# EAGLE design esquema TTH v03 filled (EAGLE 6.5.0)
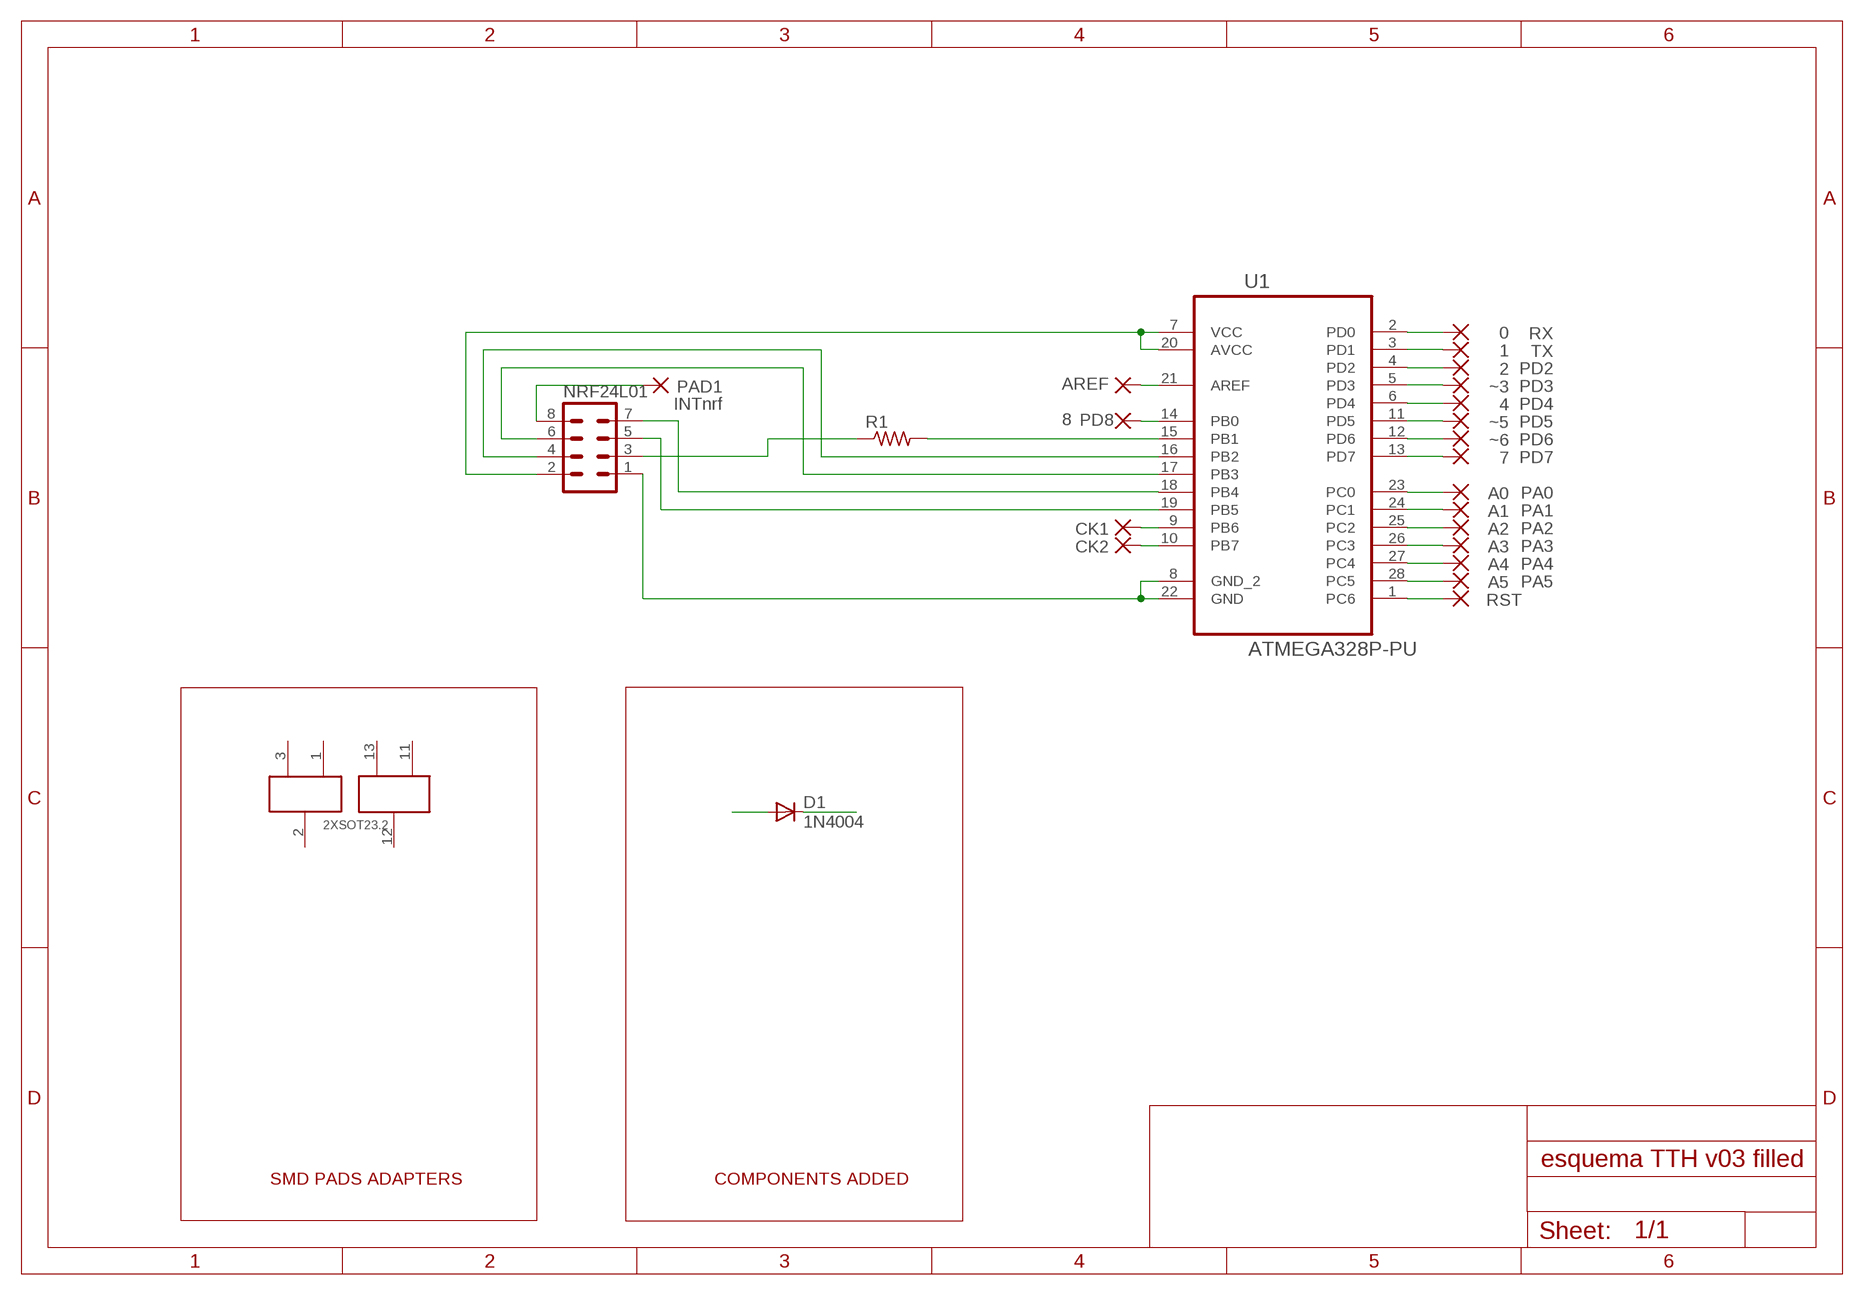
[diagram p0: schematic, sheet 1]

## Parts
2  PD2  2,15/1,0  [2,15/1,0]
4  PD4  2,15/1,0  [2,15/1,0]
7  PD7  2,15/1,0  [2,15/1,0]
8  PD8  2,15/1,0  [2,15/1,0]
A0  PA0  2,15/1,0  [2,15/1,0]
A1  PA1  2,15/1,0  [2,15/1,0]
A2  PA2  2,15/1,0  [2,15/1,0]
A3  PA3  2,15/1,0  [2,15/1,0]
A4  PA4  2,15/1,0  [2,15/1,0]
A5  PA5  2,15/1,0  [2,15/1,0]
AREF  2,15/1,0  [2,15/1,0]
CK1  2,15/1,0  [2,15/1,0]
CK2  2,15/1,0  [2,15/1,0]
D1  1N4004  [DO41-10]
NRF24L01  MA04-2  [MA04-2]
PAD1  INTnrf  2,15/1,0  [2,15/1,0]
R1  R-US_0207/10  [0207/10]
RST  2,15/1,0  [2,15/1,0]
RX  0  2,15/1,0  [2,15/1,0]
TX  1  2,15/1,0  [2,15/1,0]
U1  ATMEGA328P-PU  [DIP254P762X457-28]
U$2  2XSOT23.2  [SOT23.5]
~3  PD3  2,15/1,0  [2,15/1,0]
~5  PD5  2,15/1,0  [2,15/1,0]
~6  PD6  2,15/1,0  [2,15/1,0]

## Nets
N$2: NRF24L01.4 U1.16(PB2)
N$3: NRF24L01.8 PAD1.1(P)
N$4: NRF24L01.6 U1.17(PB3)
N$5: NRF24L01.3 R1.1
N$6: NRF24L01.5 U1.19(PB5)
N$8: R1.2 U1.15(PB1)
N$10: CK2.1(P) U1.10(PB7)
N$11: CK1.1(P) U1.9(PB6)
N$12: AREF.1(P) U1.21(AREF)
N$13: 8.1(P) U1.14(PB0)
N$14: RX.1(P) U1.2(PD0)
N$15: TX.1(P) U1.3(PD1)
N$16: 2.1(P) U1.4(PD2)
N$17: U1.5(PD3) ~3.1(P)
N$18: 4.1(P) U1.6(PD4)
N$19: U1.11(PD5) ~5.1(P)
N$20: U1.12(PD6) ~6.1(P)
N$21: 7.1(P) U1.13(PD7)
N$22: A0.1(P) U1.23(PC0)
N$23: A1.1(P) U1.24(PC1)
N$24: A2.1(P) U1.25(PC2)
N$25: A3.1(P) U1.26(PC3)
N$26: A4.1(P) U1.27(PC4)
N$27: A5.1(P) U1.28(PC5)
N$28: RST.1(P) U1.1(PC6)
N$29: NRF24L01.7 U1.18(PB4)
N$164: NRF24L01.2 U1.7(VCC) U1.20(AVCC)
N$178: D1.A
N$179: D1.C
N$191: NRF24L01.1 U1.8(GND_2) U1.22(GND)
Unconnected: U$2.1 U$2.2 U$2.3 U$2.11 U$2.12 U$2.13

## Notes on the sheet
- SMD PADS ADAPTERS | COMPONENTS ADDED

## Library data of the parts
2 4 7 8 A0 A1-A5 AREF CK1 CK2 PAD1 RST RX TX ~3 ~5 ~6 = wirepad:2,15/1,0: THROUGH-HOLE PAD
D1 = diode:1N4004: DIODE general purpose rectifier, 1 A
NRF24L01 = con-lstb:MA04-2: PIN HEADER; OC_FARNELL: unknown; OC_NEWARK: unknown
R1 = rcl:R-US_: RESISTOR, American symbol
U1 = Atmel_By_element14_Batch_1-00:ATMEGA328P-PU: 8-bit Microcontroller with In-System Programmable Flash; MPN: ATMEGA328P-PU; OC_FARNELL: 1715487; OC_NEWARK: 15R0268; PACKAGE: PDIP-28; SUPPLIER: Atmel
U$2 = smd-adapter:2XSOT23.2

## Board
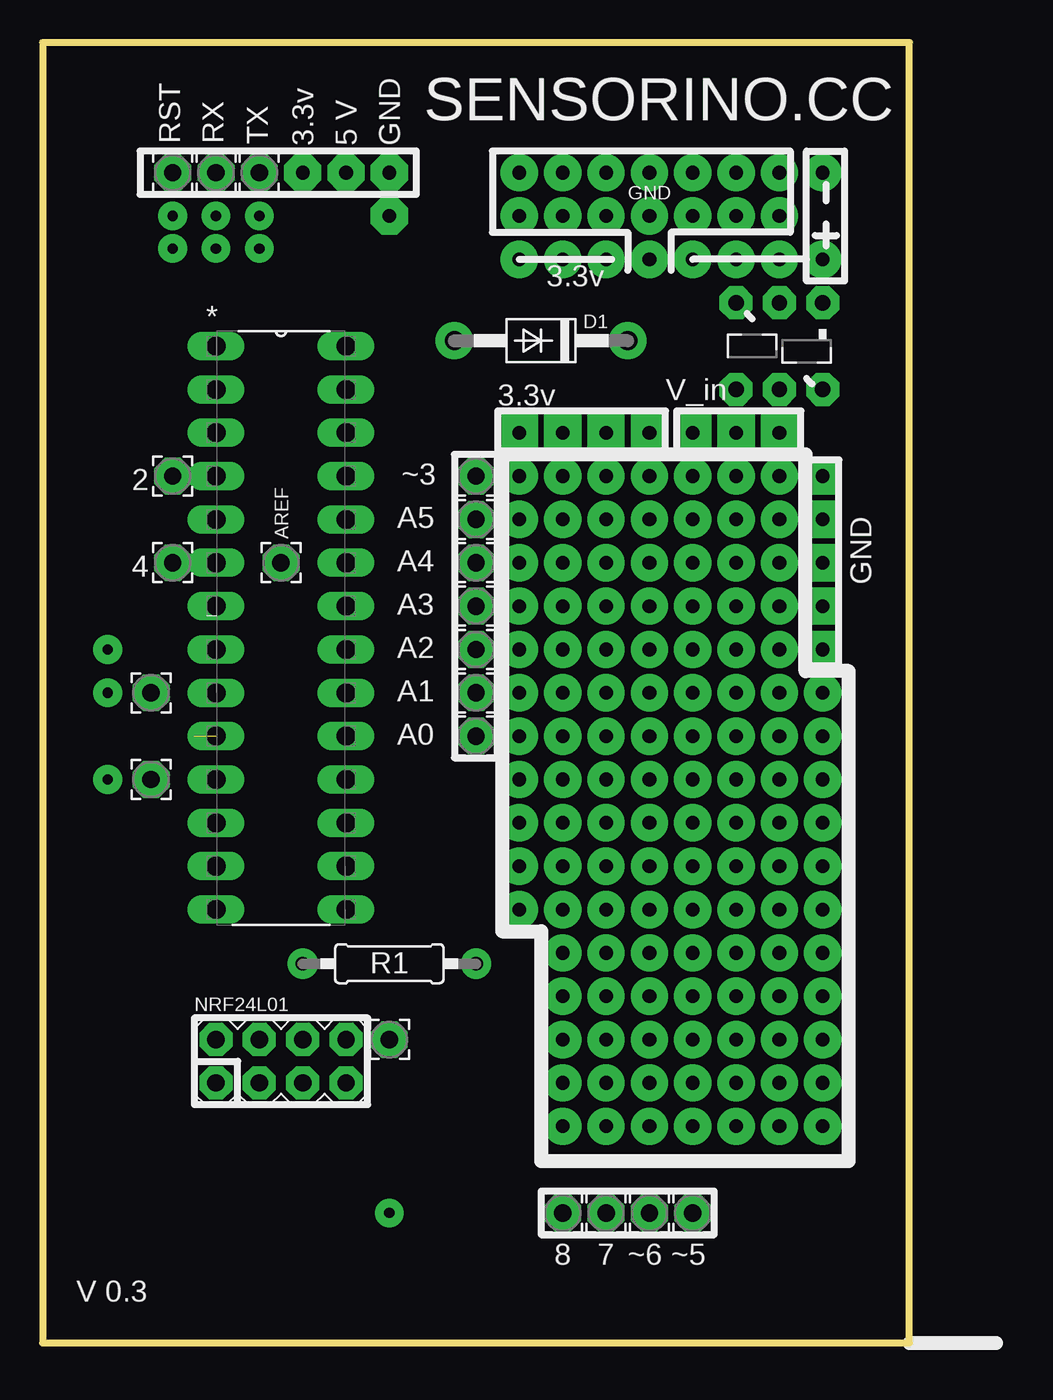
[diagram p1: board, top side]
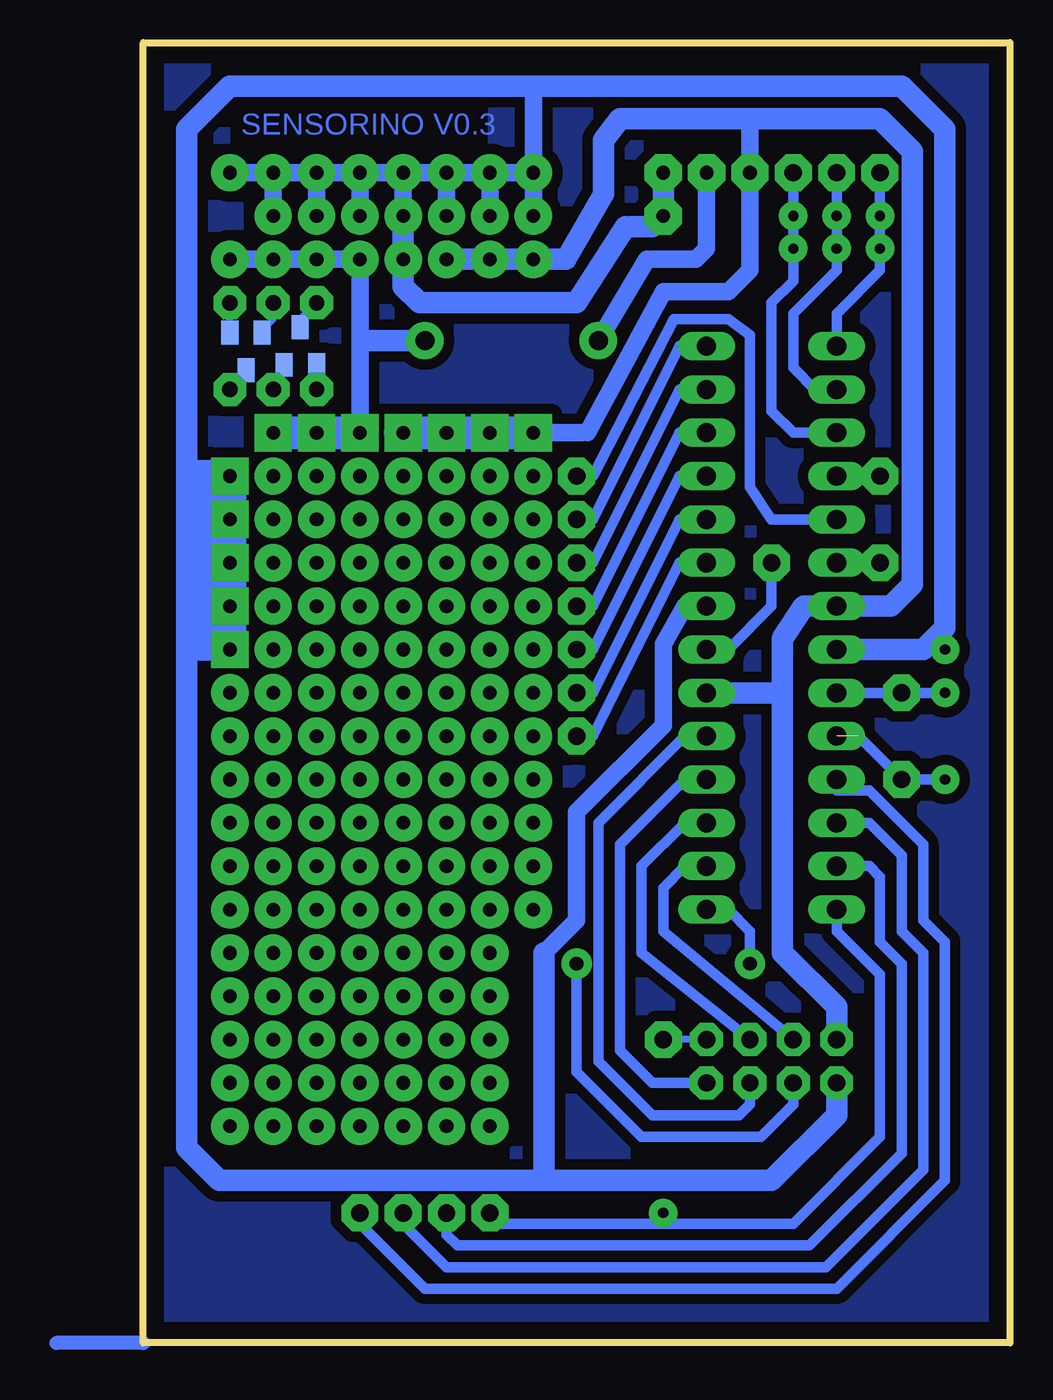
[diagram p2: board, bottom side, seen from below]

Size 50.8 x 76.2 mm. Coordinates in mm from the lower left corner, seen from the top.
Outline: 0,76.2 0,0 50.8,0 50.8,76.2 0,76.2
Copper layers (1*16): Top 0.035mm / dielectric 1.5mm / Bottom 0.035mm
Design rules "default": minimum track width 10mil, minimum drill 24mil, track to track 8mil, track to pad 8mil, pad to pad 8mil, via to via 8mil, smd to smd 8mil, copper to edge 40mil, drill to drill 8mil, minimum pad ring 10mil, minimum via ring 8mil, stop-mask expansion 4mil, vias tented up to drill 0mil, thermal gap 10mil

### Footprints (pad centres in the part's own frame; a part is rotated, then mirrored left to right if it is on the bottom)
2,15/1,0 = drill 1.016 pad 2.159 octagon: 1 0,0
DO41-10 = drill 1.118: A 5.08,0; C -5.08,0
MA04-2 = drill 1.016 pad 1.93 octagon: 1 -3.81,-1.27; 2 -3.81,1.27; 3 -1.27,-1.27; 4 -1.27,1.27; 5 1.27,-1.27; 6 1.27,1.27; 7 3.81,-1.27; 8 3.81,1.27
0207/10 = drill 0.813 octagon: 1 -5.08,0; 2 5.08,0
DIP254P762X457-28 = drill 1.118 long: 1 -7.62,33.02; 2 -7.62,30.48; 3 -7.62,27.94; 4 -7.62,25.4; 5 -7.62,22.86; 6 -7.62,20.32; 7 -7.62,17.78; 8 -7.62,15.24; 9 -7.62,12.7; 10 -7.62,10.16; 11 -7.62,7.62; 12 -7.62,5.08; 13 -7.62,2.54; 14 -7.62,0; 15 0,0; 16 0,2.54; 17 0,5.08; 18 0,7.62; 19 0,10.16; 20 0,12.7; 21 0,15.24; 22 0,17.78; 23 0,20.32; 24 0,22.86; 25 0,25.4; 26 0,27.94; 27 0,30.48; 28 0,33.02
SOT23.5 = drill 0.9 pad 1.93 octagon: 1 -2.54,-2.54; 2 -2.54,2.54; 3 0,-2.54; 11 2.54,2.54; 12 2.54,-2.54; 13 0,2.54 | smd 1 x 1.4 bottom: NC6 -1.587,1.417; NC7 -0.637,-0.782; NC8 -2.538,-0.782; NC9 1.587,-1.1; NC10 0.637,1.1; NC11 2.538,1.1

### Placement (x,y rotation side)
2  7.62,50.8 0 top
4  7.62,45.72 0 top
7  33.02,7.62 0 top
8  30.48,7.62 0 top
A0  25.4,35.56 0 top
A1  25.4,38.1 0 top
A2  25.4,40.64 0 top
A3  25.4,43.18 0 top
A4  25.4,45.72 0 top
A5  25.4,48.26 0 top
AREF  13.97,45.72 0 top
CK1  6.35,38.1 0 top
CK2  6.35,33.02 0 top
D1  29.21,58.74 180 top
NRF24L01  13.97,16.51 0 top
PAD1  20.32,17.78 90 top
R1  20.32,22.23 180 top
RST  7.62,68.58 0 top
RX  10.16,68.58 0 top
TX  12.7,68.58 0 top
U1  17.78,25.4 0 top
U$2  43.18,58.42 180 top
~3  25.4,50.8 0 top
~5  38.1,7.62 0 top
~6  35.56,7.62 0 top

### Tracks (layer width: path | path; a pad name or v marks a point on that pad's centre or on a via)
N$1
  Bottom 1.016: 38.1,63.18 38.1,53.66
N$2
  Bottom 0.61: U1.16 19.05,27.94 20.32,26.67 20.32,24.13 NRF24L01.4
N$3
  Bottom 0.406: NRF24L01.8 PAD1.1
N$4
  Bottom 0.61: U1.17 19.05,30.48 21.59,27.94 21.59,22.86 NRF24L01.6
N$5
  Bottom 0.61: NRF24L01.3 12.7,13.97 14.61,12.06 21.59,12.06 25.4,15.88 R1.1
N$6
  Bottom 0.61: U1.19 19.05,35.56 24.13,30.48 24.13,16.51 20.95,13.34 15.88,13.34 15.24,13.97 NRF24L01.5
N$7  (via drill 0.6 pad 1.68)
  other vias: 3.81,33.02
N$8
  Bottom 0.61: U1.15 16.51,25.4 15.24,24.13 R1.2
N$9  (via drill 0.6 pad 1.68)
  other vias: 3.81,38.1
N$10  (1 unrouted)
  Bottom 0.61: CK2.1 8.89,35.56
N$11
  Bottom 0.61: U1.9 CK1.1
N$12
  Bottom 0.61: AREF.1 13.97,43.18 16.51,40.64 U1.21
N$13
  Bottom 0.61: U1.14 10.16,24.13 7.62,21.59 7.62,12.06 12.7,6.99 29.84,6.99 8.1
N$14
  Bottom 0.61: U1.2 11.43,55.88 12.7,57.15 12.7,60.33 10.16,62.87 RX.1
N$15
  Bottom 0.61: U1.3 12.7,53.34 13.97,54.61 13.97,60.96 12.7,62.23 TX.1
N$16
  Bottom 0.61: 2.1 U1.4
N$17
  Bottom 0.61: U1.5 13.97,48.26 15.24,50.16 15.24,59.05 16.51,60.01 19.68,60.01 24.45,50.8 ~3.1
N$18
  Bottom 0.61: 4.1 U1.6
N$19
  Bottom 0.61: U1.11 10.16,32.38 8.26,32.38 5.08,29.21 5.08,24.77 3.81,23.5 3.81,9.53 10.16,3.17 34.29,3.17 38.1,6.99 ~5.1
N$20
  Bottom 0.61: U1.12 8.26,30.48 6.35,28.57 6.35,24.13 5.08,22.86 5.08,10.16 10.79,4.45 33.02,4.45 35.56,6.99 ~6.1
N$21
  Bottom 0.61: U1.13 8.26,27.94 7.62,27.3 7.62,23.5 6.35,22.23 6.35,11.11 11.75,5.71 32.38,5.71 33.02,6.35 7.1
N$22
  Bottom 0.61: U1.23 19.37,45.72 24.45,35.56 A0.1
N$23
  Bottom 0.61: U1.24 19.37,48.26 24.45,38.1 A1.1
N$24
  Bottom 0.61: U1.25 19.37,50.8 24.45,40.64 A2.1
N$25
  Bottom 0.61: U1.26 19.37,53.34 24.45,43.18 A3.1
N$26
  Bottom 0.61: U1.27 19.37,55.88 24.45,45.72 A4.1
N$27
  Bottom 0.61: U1.28 19.37,58.42 24.45,48.26 A5.1
N$28
  Bottom 0.61: U1.1 10.16,60.33 7.62,62.87 RST.1
N$29
  Bottom 0.61: 19.05,15.24 NRF24L01.7 20.95,15.24 22.86,17.14 22.86,29.21 19.05,33.02 U1.18
N$30  (via drill 0.8 pad 2.18)
  Bottom 1.016: v45.72,63.5 v38.1,63.5
N$31  (via drill 0.6 pad 1.68)
  other vias: 20.32,7.62
N$32
  Bottom 1.016: 24.13,58.74 21.27,63.5
N$33
  Bottom 0.61: 3.49,33.02 6.35,33.02
N$34
  Bottom 0.61: 6.35,38.1 3.49,38.1
N$35  (via drill 0.6 pad 1.68)
  other vias: 3.81,40.64
N$36  (via drill 0.6 pad 1.68)
  other vias: 12.7,66.04
N$37  (via drill 0.8 pad 2.18)
  other vias: 38.1,12.7
N$38  (via drill 0.8 pad 2.18)
  other vias: 40.64,12.7
N$39  (via drill 0.8 pad 2.18)
  other vias: 43.18,12.7
N$40  (via drill 0.8 pad 2.18)
  other vias: 35.56,12.7
N$41  (via drill 0.8 pad 2.18)
  other vias: 33.02,12.7
N$42  (via drill 0.8 pad 2.18)
  other vias: 30.48,12.7
N$43  (via drill 0.8 pad 2.18)
  other vias: 30.48,15.24
N$44  (via drill 0.8 pad 2.18)
  other vias: 33.02,15.24
N$45  (via drill 0.8 pad 2.18)
  other vias: 35.56,15.24
N$46  (via drill 0.8 pad 2.18)
  other vias: 38.1,15.24
N$47  (via drill 0.8 pad 2.18)
  other vias: 40.64,15.24
N$48  (via drill 0.8 pad 2.18)
  other vias: 43.18,15.24
N$49  (via drill 0.8 pad 2.18)
  other vias: 45.72,15.24
N$50  (via drill 0.8 pad 2.18)
  other vias: 45.72,17.78
N$51  (via drill 0.8 pad 2.18)
  other vias: 43.18,17.78
N$52  (via drill 0.8 pad 2.18)
  other vias: 40.64,17.78
N$53  (via drill 0.8 pad 2.18)
  other vias: 38.1,17.78
N$54  (via drill 0.8 pad 2.18)
  other vias: 35.56,17.78
N$55  (via drill 0.8 pad 2.18)
  other vias: 33.02,17.78
N$56  (via drill 0.8 pad 2.18)
  other vias: 30.48,17.78
N$57  (via drill 0.8 pad 2.18)
  other vias: 30.48,20.32
N$58  (via drill 0.8 pad 2.18)
  other vias: 33.02,20.32
N$59  (via drill 0.8 pad 2.18)
  other vias: 35.56,20.32
N$60  (via drill 0.8 pad 2.18)
  other vias: 38.1,20.32
N$61  (via drill 0.8 pad 2.18)
  other vias: 40.64,20.32
N$62  (via drill 0.8 pad 2.18)
  other vias: 43.18,20.32
N$63  (via drill 0.8 pad 2.18)
  other vias: 45.72,20.32
N$64  (via drill 0.8 pad 2.18)
  other vias: 45.72,22.86
N$65  (via drill 0.8 pad 2.18)
  other vias: 43.18,22.86
N$66  (via drill 0.8 pad 2.18)
  other vias: 40.64,22.86
N$67  (via drill 0.8 pad 2.18)
  other vias: 38.1,22.86
N$68  (via drill 0.8 pad 2.18)
  other vias: 35.56,22.86
N$69  (via drill 0.8 pad 2.18)
  other vias: 33.02,22.86
N$70  (via drill 0.8 pad 2.18)
  other vias: 30.48,22.86
N$71  (via drill 0.8 pad 2.18)
  other vias: 30.48,25.4
N$72  (via drill 0.8 pad 2.18)
  other vias: 33.02,25.4
N$73  (via drill 0.8 pad 2.18)
  other vias: 35.56,25.4
N$74  (via drill 0.8 pad 2.18)
  other vias: 38.1,25.4
N$75  (via drill 0.8 pad 2.18)
  other vias: 40.64,25.4
N$76  (via drill 0.8 pad 2.18)
  other vias: 43.18,25.4
N$77  (via drill 0.8 pad 2.18)
  other vias: 45.72,25.4
N$78  (via drill 0.8 pad 2.18)
  other vias: 45.72,27.94
N$79  (via drill 0.8 pad 2.18)
  other vias: 43.18,27.94
N$80  (via drill 0.8 pad 2.18)
  other vias: 40.64,27.94
N$81  (via drill 0.8 pad 2.18)
  other vias: 38.1,27.94
N$82  (via drill 0.8 pad 2.18)
  other vias: 35.56,27.94
N$83  (via drill 0.8 pad 2.18)
  other vias: 33.02,27.94
N$84  (via drill 0.8 pad 2.18)
  other vias: 30.48,27.94
N$85  (via drill 0.8 pad 2.18)
  other vias: 30.48,30.48
N$86  (via drill 0.8 pad 2.18)
  other vias: 33.02,30.48
N$87  (via drill 0.8 pad 2.18)
  other vias: 35.56,30.48
N$88  (via drill 0.8 pad 2.18)
  other vias: 38.1,30.48
N$89  (via drill 0.8 pad 2.18)
  other vias: 40.64,30.48
N$90  (via drill 0.8 pad 2.18)
  other vias: 43.18,30.48
N$91  (via drill 0.8 pad 2.18)
  other vias: 45.72,30.48
N$92  (via drill 0.8 pad 2.18)
  other vias: 45.72,33.02
N$93  (via drill 0.8 pad 2.18)
  other vias: 43.18,33.02
N$94  (via drill 0.8 pad 2.18)
  other vias: 40.64,33.02
N$95  (via drill 0.8 pad 2.18)
  other vias: 38.1,33.02
N$96  (via drill 0.8 pad 2.18)
  other vias: 35.56,33.02
N$97  (via drill 0.8 pad 2.18)
  other vias: 33.02,33.02
N$98  (via drill 0.8 pad 2.18)
  other vias: 30.48,33.02
N$99  (via drill 0.8 pad 2.18)
  other vias: 30.48,35.56
N$100  (via drill 0.8 pad 2.18)
  other vias: 33.02,35.56
N$101  (via drill 0.8 pad 2.18)
  other vias: 35.56,35.56
N$102  (via drill 0.8 pad 2.18)
  other vias: 38.1,35.56
N$103  (via drill 0.8 pad 2.18)
  other vias: 40.64,35.56
N$104  (via drill 0.8 pad 2.18)
  other vias: 43.18,35.56
N$105  (via drill 0.8 pad 2.18)
  other vias: 45.72,35.56
N$106  (via drill 0.8 pad 2.18)
  other vias: 45.72,12.7
N$107  (via drill 0.8 pad 2.18)
  other vias: 45.72,38.1
N$108  (via drill 0.8 pad 2.18)
  other vias: 43.18,38.1
N$109  (via drill 0.8 pad 2.18)
  other vias: 40.64,38.1
N$110  (via drill 0.8 pad 2.18)
  other vias: 38.1,38.1
N$111  (via drill 0.8 pad 2.18)
  other vias: 35.56,38.1
N$112  (via drill 0.8 pad 2.18)
  other vias: 33.02,38.1
N$113  (via drill 0.8 pad 2.18)
  other vias: 30.48,38.1
N$114  (via drill 0.8 pad 2.18)
  other vias: 30.48,40.64
N$115  (via drill 0.8 pad 2.18)
  other vias: 33.02,40.64
N$116  (via drill 0.8 pad 2.18)
  other vias: 35.56,40.64
N$117  (via drill 0.8 pad 2.18)
  Bottom 1.27: 22.23,65.41 20.95,65.41 v20.32,66.04 20.32,67.94
N$118  (via drill 0.8 pad 2.18)
  other vias: 20.32,68.58
N$119  (via drill 0.8 pad 2.18)
  other vias: 35.56,63.5
N$120  (via drill 0.8 pad 2.18)
  other vias: 27.94,30.48
N$121  (via drill 0.8 pad 2.18)
  other vias: 27.94,27.94
N$122  (via drill 0.8 pad 2.18)
  other vias: 27.94,25.4
N$123  (via drill 0.8 pad 2.18)
  Bottom 1.016: 20.95,63.5 18.41,63.5 17.78,64.14 v17.78,68.58
N$124  (via drill 0.8 pad 2.18)
  other vias: 38.1,50.8
N$125  (via drill 0.8 pad 2.18)
  other vias: 35.56,43.18
N$126  (via drill 0.8 pad 2.18)
  other vias: 33.02,43.18
N$127  (via drill 0.8 pad 2.18)
  other vias: 30.48,43.18
N$128  (via drill 0.8 pad 2.18)
  other vias: 30.48,45.72
N$129  (via drill 0.8 pad 2.18)
  other vias: 33.02,45.72
N$130  (via drill 0.8 pad 2.18)
  other vias: 35.56,45.72
N$131  (via drill 0.8 pad 2.18)
  other vias: 40.64,50.8
N$132  (via drill 0.8 pad 2.18)
  other vias: 43.18,50.8
N$133
  Bottom 1.016: 25.08,53.34 35.24,53.34 36.2,53.34
N$134  (via drill 0.8 pad 2.18)
  other vias: 43.18,48.26
N$135  (via drill 0.8 pad 2.18)
  other vias: 45.72,48.26
N$136  (via drill 0.8 pad 2.18)
  other vias: 45.72,45.72
N$137  (via drill 0.8 pad 2.18)
  other vias: 45.72,43.18
N$138  (via drill 0.8 pad 2.18)
  other vias: 40.64,48.26
N$139  (via drill 0.8 pad 2.18)
  other vias: 35.56,48.26
N$140  (via drill 0.8 pad 2.18)
  other vias: 33.02,48.26
N$141  (via drill 0.8 pad 2.18)
  other vias: 30.48,48.26
N$142  (via drill 0.8 pad 2.18)
  other vias: 30.48,50.8
N$143  (via drill 0.8 pad 2.18)
  other vias: 33.02,50.8
N$144  (via drill 0.8 pad 2.18)
  other vias: 35.56,50.8
N$145  (via drill 0.8 pad 2.18)
  other vias: 38.1,48.26
N$146  (via drill 0.8 pad 2.18)
  other vias: 38.1,45.72
N$147  (via drill 0.8 pad 2.18)
  other vias: 40.64,45.72
N$148  (via drill 0.8 pad 2.18)
  other vias: 43.18,45.72
N$149  (via drill 0.8 pad 2.18)
  other vias: 43.18,43.18
N$150  (via drill 0.8 pad 2.18)
  other vias: 40.64,43.18
N$151  (via drill 0.8 pad 2.18)
  other vias: 38.1,43.18
N$152  (via drill 0.8 pad 2.18)
  other vias: 38.1,40.64
N$153  (via drill 0.8 pad 2.18)
  other vias: 35.56,53.34
N$154  (via drill 0.8 pad 2.18)
  other vias: 33.02,53.34
N$155  (via drill 0.8 pad 2.18)
  other vias: 30.48,53.34
N$156  (via drill 0.8 pad 2.18)
  other vias: 40.64,40.64
N$157  (via drill 0.8 pad 2.18)
  other vias: 27.94,40.64
N$158  (via drill 0.8 pad 2.18)
  other vias: 27.94,63.5
N$159  (via drill 0.8 pad 2.18)
  other vias: 30.48,68.58
N$160  (via drill 0.8 pad 2.18)
  Bottom 1.016: 30.48,67.94 v30.48,66.04
N$161  (via drill 0.8 pad 2.18)
  other vias: 30.48,63.5
N$162  (via drill 0.8 pad 2.18)
  Bottom 1.016: v33.02,68.58 v33.02,66.04
N$163  (via drill 0.8 pad 2.18)
  Bottom 1.016: v43.18,53.34 v40.64,53.34 v38.1,53.34
N$164  (via drill 0.8 pad 2.18)
  Bottom 1.016: 15.24,71.75 v15.24,68.58 15.24,62.87 16.51,61.59 20.32,61.59 24.77,53.34
  Bottom 1.27: v33.02,63.5 26.04,63.5 23.81,67.31 23.81,70.48 22.86,71.75 15.24,71.75 7.62,71.75 5.71,69.85 5.71,44.45 6.99,43.18 U1.7 12.06,43.18 13.34,41.27 13.34,38.1 | NRF24L01.2 10.16,19.68 13.34,22.86 13.34,38.1 | 13.34,38.1 U1.20
N$165  (via drill 0.8 pad 2.18)
  other vias: 35.56,68.58
N$166  (via drill 0.8 pad 2.18)
  other vias: 27.94,43.18
N$167  (via drill 0.8 pad 2.18)
  other vias: 43.18,40.64
N$168  (via drill 0.8 pad 2.18)
  other vias: 38.1,68.58
N$169  (via drill 0.8 pad 2.18)
  other vias: 27.94,45.72
N$170
  Bottom 1.27: 37.78,58.74 33.97,58.74
N$171  (via drill 0.6 pad 1.68)
  other vias: 7.62,66.04
N$172  (via drill 0.6 pad 1.68)
  other vias: 7.62,64.14
N$173  (via drill 0.6 pad 1.68)
  other vias: 10.16,64.14
N$174  (via drill 0.6 pad 1.68)
  other vias: 12.7,64.14
N$175  (via drill 0.6 pad 1.68)
  other vias: 10.16,66.04
N$176  (via drill 0.6 pad 1.78)
  other vias: 25.4,22.23
N$177  (via drill 0.6 pad 1.78)
  other vias: 15.24,22.23
N$180
  pour Bottom (isolate 0.61): 50.8,0 0,0 0,76.2 50.8,76.2
N$181  (via drill 0.8 pad 2.18)
  other vias: 27.94,33.02
N$182  (via drill 0.8 pad 2.18)
  other vias: 27.94,35.56
N$183  (via drill 0.8 pad 2.18)
  other vias: 27.94,38.1
N$184  (via drill 0.8 pad 2.18)
  other vias: 27.94,48.26
N$185  (via drill 0.8 pad 2.18)
  other vias: 34.29,58.74
N$186  (via drill 0.8 pad 2.18)
  other vias: 27.94,53.34
N$187  (via drill 0.8 pad 2.18)
  other vias: 40.64,63.5
N$188  (via drill 0.8 pad 2.18)
  other vias: 27.94,50.8
N$189  (via drill 0.8 pad 2.18)
  Bottom 1.016: v40.64,68.58 v40.64,66.04
N$190  (via drill 0.8 pad 2.18)
  other vias: 43.18,68.58
N$191  (via drill 0.8 pad 2.18)
  Bottom 1.016: 22.86,9.53 23.5,9.53 | 27.3,22.86 25.4,24.77 25.4,31.11 20.32,36.2 20.32,40.96 19.05,43.18 U1.22 | v27.94,68.58 35.56,68.58 | 35.56,68.58 38.1,68.58 | v27.94,68.58 v27.94,66.04 | 35.56,68.58 v35.56,66.04 | 38.1,68.58 v38.1,66.04 | 27.94,73.66 v27.94,68.58 | 48.26,50.8 v45.72,50.8 v45.72,40.64 47.94,40.64 | 38.1,68.58 43.18,68.58 | 43.18,68.58 v45.72,68.58 | v43.18,66.04 43.18,68.58
  Bottom 1.27: NRF24L01.1 10.16,13.34 13.97,9.53 22.86,9.53 27.3,9.53 | 27.3,9.53 27.3,22.86 | U1.8 5.08,40.64 3.81,41.91 3.81,71.12 6.35,73.66 27.94,73.66 45.72,73.66 48.26,71.12 48.26,50.8 48.26,11.43 46.35,9.53 27.3,9.53 | 38.1,68.58 38.73,68.58 | v35.56,66.04 35.56,61.91 34.61,60.96 25.4,60.96 22.54,65.41
N$192  (via drill 0.8 pad 2.18)
  other vias: 43.18,63.5
N$193  (via drill 0.8 pad 2.18)
  other vias: 24.13,58.74
S$1
  Bottom 0.813: 50.8,0 55.88,0
(copper drawn outside any net)
  shapes: Bottom area x3

### Text on the board
Bottom: SENSORINO V0.3
tNames: SENSORINO.CC | 3.3v | 5 V | GND | GND | 3.3v | 3.3v | V_in | GND | V 0.3